# Altium schematic sheet eeprom.schdoc
size 209 x 297 mm
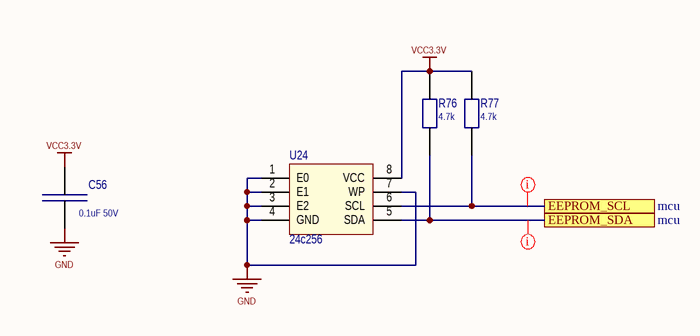
[diagram p0: eeprom.schdoc]

## Parts
C56  0.1uF 50V  [C_0603]
R76  4.7k  [R_0603]
R77  4.7k  [R_0603]
U24  24c256  [SO-8_M]

## Ports
EEPROM_SCL (see mcu), EEPROM_SDA (see mcu)

## Nets
GND: C56.1 U24.1(E0) U24.2(E1) U24.3(E2) U24.4(GND) U24.7(WP)
VCC3.3V: C56.2 R76.2 R77.2 U24.8(VCC)
EEPROM_SCL: R77.1 U24.6(SCL) ; port EEPROM_SCL
EEPROM_SDA: R76.1 U24.5(SDA) ; port EEPROM_SDA

## Layout directives
net class I2C_EEPROM: EEPROM_SCL, EEPROM_SDA

## Library data of the parts
C56 = C0603: Capacitor; Part: CC0603KPX7R9BB104; Value: 0.1uF 50V; JLCPCB Part: C14663
R76 R77 = RES_SMD: Resistor; Part: RC0603FR-074K7L; Alternative Part: *; Value: 4.7k; JLCPCB Part: C99782
U24 = 24c256: 256-Kbit I2C-compatible Serial EEPROM; Part: AT24C256C; JLCPCB Part: C6482